# EAGLE schematic AddSub (EAGLE 8.5.1)
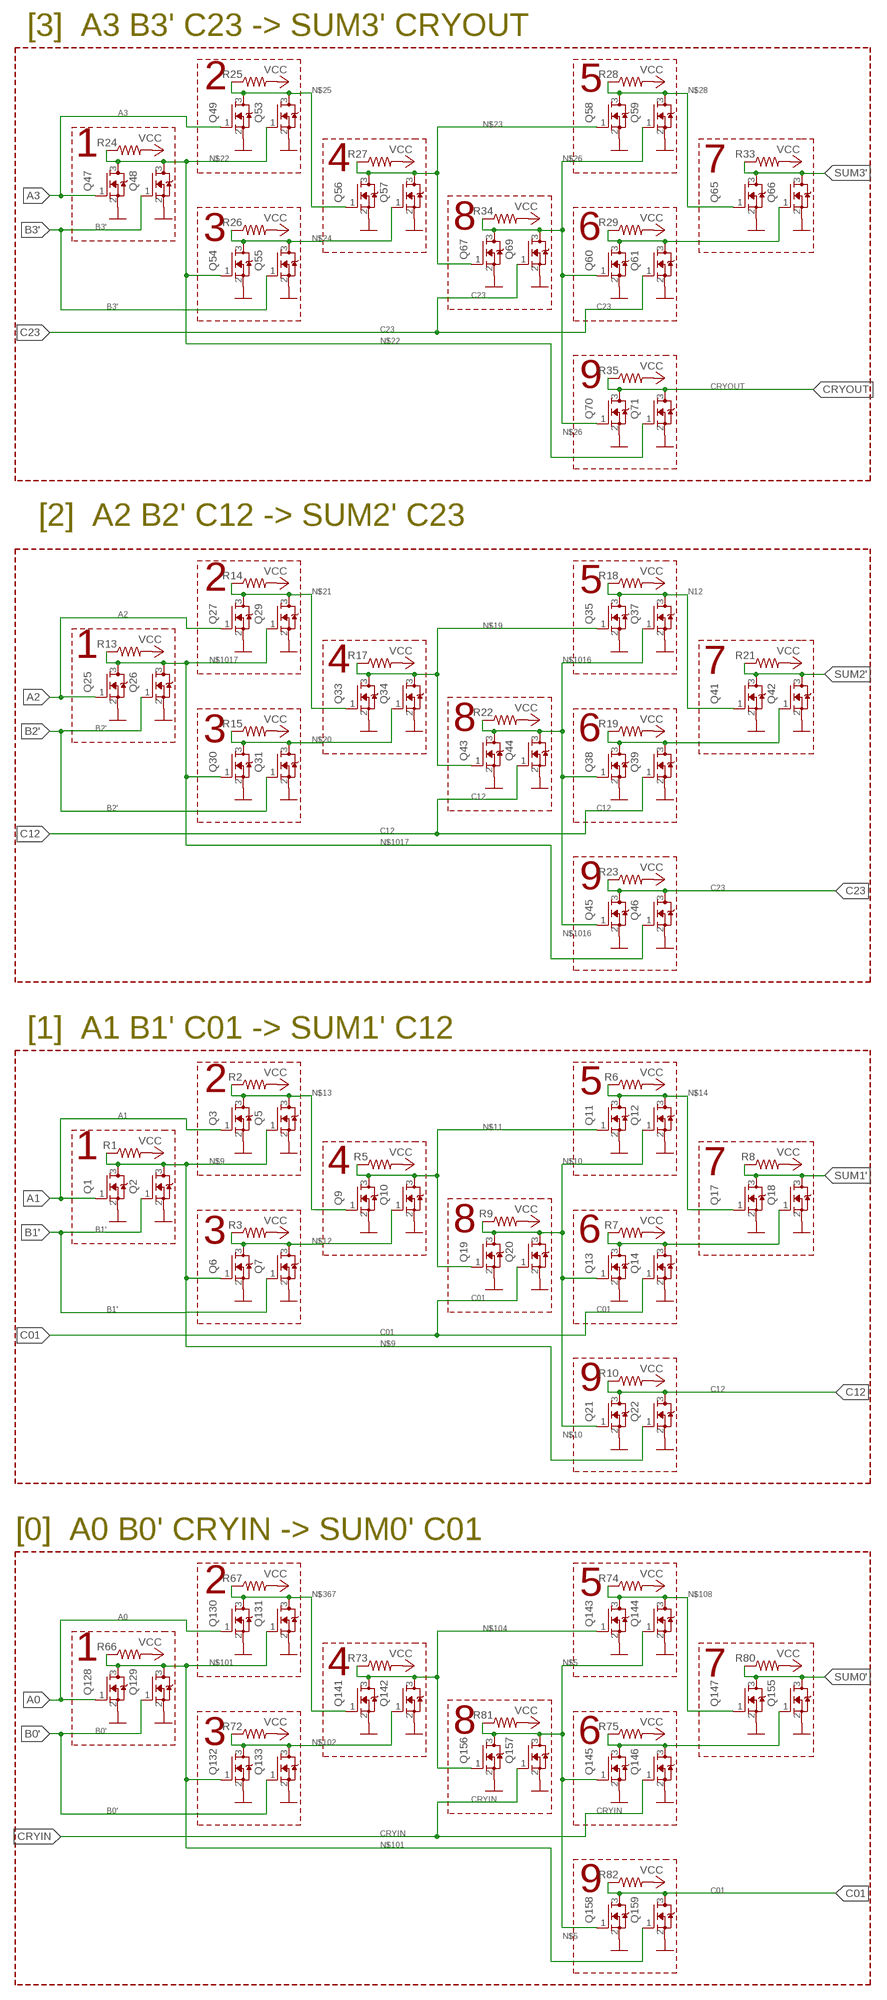
[diagram p0: schematic, sheet 1, part 1 of 2]
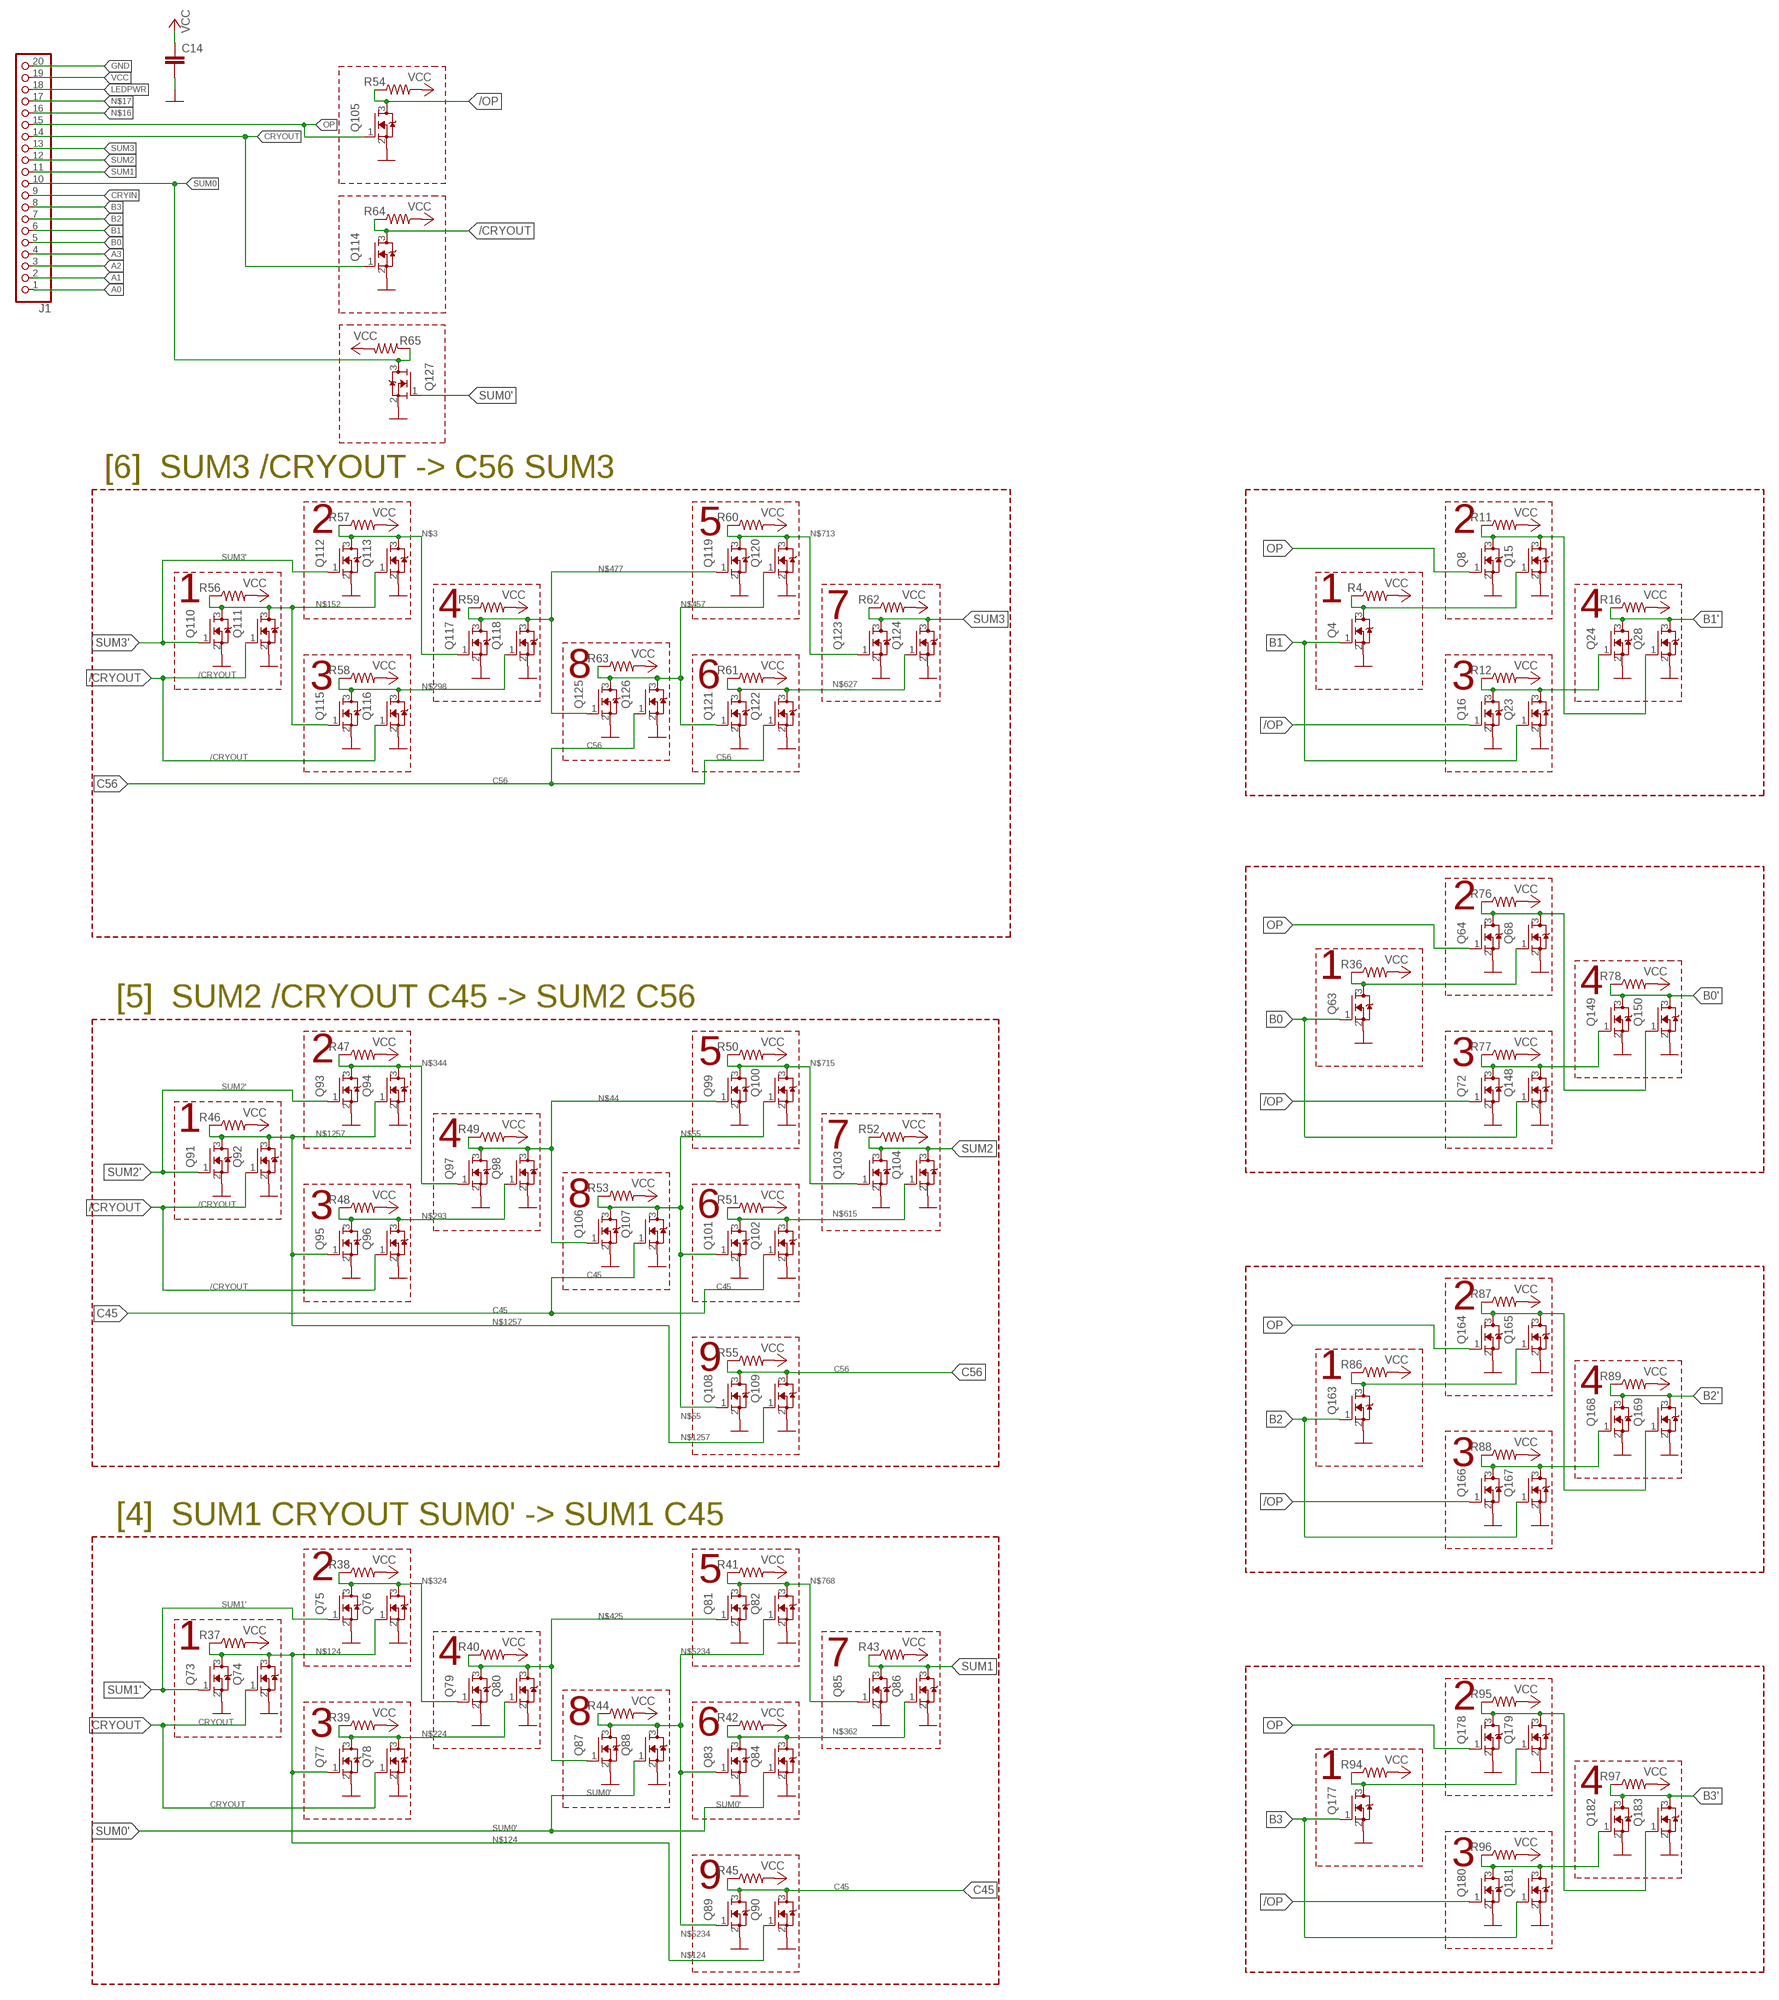
[diagram p1: schematic, sheet 1, part 2 of 2]

## Parts
C14  C-EUC0805  [C0805]
J1  PINHD-1X20/90  [1X20/90]
Q1  310mA/60V/1.6Ω  NMOSREFLOW  [SOT23]
Q2  310mA/60V/1.6Ω  NMOSREFLOW  [SOT23]
Q3  310mA/60V/1.6Ω  NMOSREFLOW  [SOT23]
Q4  310mA/60V/1.6Ω  NMOSREFLOW  [SOT23]
Q5  310mA/60V/1.6Ω  NMOSREFLOW  [SOT23]
Q6  310mA/60V/1.6Ω  NMOSREFLOW  [SOT23]
Q7  310mA/60V/1.6Ω  NMOSREFLOW  [SOT23]
Q8  310mA/60V/1.6Ω  NMOSREFLOW  [SOT23]
Q9  310mA/60V/1.6Ω  NMOSREFLOW  [SOT23]
Q10  310mA/60V/1.6Ω  NMOSREFLOW  [SOT23]
Q11  310mA/60V/1.6Ω  NMOSREFLOW  [SOT23]
Q12  310mA/60V/1.6Ω  NMOSREFLOW  [SOT23]
Q13  310mA/60V/1.6Ω  NMOSREFLOW  [SOT23]
Q14  310mA/60V/1.6Ω  NMOSREFLOW  [SOT23]
Q15  310mA/60V/1.6Ω  NMOSREFLOW  [SOT23]
Q16  310mA/60V/1.6Ω  NMOSREFLOW  [SOT23]
Q17  310mA/60V/1.6Ω  NMOSREFLOW  [SOT23]
Q18  310mA/60V/1.6Ω  NMOSREFLOW  [SOT23]
Q19  310mA/60V/1.6Ω  NMOSREFLOW  [SOT23]
Q20  310mA/60V/1.6Ω  NMOSREFLOW  [SOT23]
Q21  310mA/60V/1.6Ω  NMOSREFLOW  [SOT23]
Q22  310mA/60V/1.6Ω  NMOSREFLOW  [SOT23]
Q23  310mA/60V/1.6Ω  NMOSREFLOW  [SOT23]
Q24  310mA/60V/1.6Ω  NMOSREFLOW  [SOT23]
Q25  310mA/60V/1.6Ω  NMOSREFLOW  [SOT23]
Q26  310mA/60V/1.6Ω  NMOSREFLOW  [SOT23]
Q27  310mA/60V/1.6Ω  NMOSREFLOW  [SOT23]
Q28  310mA/60V/1.6Ω  NMOSREFLOW  [SOT23]
Q29  310mA/60V/1.6Ω  NMOSREFLOW  [SOT23]
Q30  310mA/60V/1.6Ω  NMOSREFLOW  [SOT23]
Q31  310mA/60V/1.6Ω  NMOSREFLOW  [SOT23]
Q33  310mA/60V/1.6Ω  NMOSREFLOW  [SOT23]
Q34  310mA/60V/1.6Ω  NMOSREFLOW  [SOT23]
Q35  310mA/60V/1.6Ω  NMOSREFLOW  [SOT23]
Q37  310mA/60V/1.6Ω  NMOSREFLOW  [SOT23]
Q38  310mA/60V/1.6Ω  NMOSREFLOW  [SOT23]
Q39  310mA/60V/1.6Ω  NMOSREFLOW  [SOT23]
Q41  310mA/60V/1.6Ω  NMOSREFLOW  [SOT23]
Q42  310mA/60V/1.6Ω  NMOSREFLOW  [SOT23]
Q43  310mA/60V/1.6Ω  NMOSREFLOW  [SOT23]
Q44  310mA/60V/1.6Ω  NMOSREFLOW  [SOT23]
Q45  310mA/60V/1.6Ω  NMOSREFLOW  [SOT23]
Q46  310mA/60V/1.6Ω  NMOSREFLOW  [SOT23]
Q47  310mA/60V/1.6Ω  NMOSREFLOW  [SOT23]
Q48  310mA/60V/1.6Ω  NMOSREFLOW  [SOT23]
Q49  310mA/60V/1.6Ω  NMOSREFLOW  [SOT23]
Q53  310mA/60V/1.6Ω  NMOSREFLOW  [SOT23]
Q54  310mA/60V/1.6Ω  NMOSREFLOW  [SOT23]
Q55  310mA/60V/1.6Ω  NMOSREFLOW  [SOT23]
Q56  310mA/60V/1.6Ω  NMOSREFLOW  [SOT23]
Q57  310mA/60V/1.6Ω  NMOSREFLOW  [SOT23]
Q58  310mA/60V/1.6Ω  NMOSREFLOW  [SOT23]
Q59  310mA/60V/1.6Ω  NMOSREFLOW  [SOT23]
Q60  310mA/60V/1.6Ω  NMOSREFLOW  [SOT23]
Q61  310mA/60V/1.6Ω  NMOSREFLOW  [SOT23]
Q63  310mA/60V/1.6Ω  NMOSREFLOW  [SOT23]
Q64  310mA/60V/1.6Ω  NMOSREFLOW  [SOT23]
Q65  310mA/60V/1.6Ω  NMOSREFLOW  [SOT23]
Q66  310mA/60V/1.6Ω  NMOSREFLOW  [SOT23]
Q67  310mA/60V/1.6Ω  NMOSREFLOW  [SOT23]
Q68  310mA/60V/1.6Ω  NMOSREFLOW  [SOT23]
Q69  310mA/60V/1.6Ω  NMOSREFLOW  [SOT23]
Q70  310mA/60V/1.6Ω  NMOSREFLOW  [SOT23]
Q71  310mA/60V/1.6Ω  NMOSREFLOW  [SOT23]
Q72  310mA/60V/1.6Ω  NMOSREFLOW  [SOT23]
Q73  310mA/60V/1.6Ω  NMOSREFLOW  [SOT23]
Q74  310mA/60V/1.6Ω  NMOSREFLOW  [SOT23]
Q75  310mA/60V/1.6Ω  NMOSREFLOW  [SOT23]
Q76  310mA/60V/1.6Ω  NMOSREFLOW  [SOT23]
Q77  310mA/60V/1.6Ω  NMOSREFLOW  [SOT23]
Q78  310mA/60V/1.6Ω  NMOSREFLOW  [SOT23]
Q79  310mA/60V/1.6Ω  NMOSREFLOW  [SOT23]
Q80  310mA/60V/1.6Ω  NMOSREFLOW  [SOT23]
Q81  310mA/60V/1.6Ω  NMOSREFLOW  [SOT23]
Q82  310mA/60V/1.6Ω  NMOSREFLOW  [SOT23]
Q83  310mA/60V/1.6Ω  NMOSREFLOW  [SOT23]
Q84  310mA/60V/1.6Ω  NMOSREFLOW  [SOT23]
Q85  310mA/60V/1.6Ω  NMOSREFLOW  [SOT23]
Q86  310mA/60V/1.6Ω  NMOSREFLOW  [SOT23]
Q87  310mA/60V/1.6Ω  NMOSREFLOW  [SOT23]
Q88  310mA/60V/1.6Ω  NMOSREFLOW  [SOT23]
Q89  310mA/60V/1.6Ω  NMOSREFLOW  [SOT23]
Q90  310mA/60V/1.6Ω  NMOSREFLOW  [SOT23]
Q91  310mA/60V/1.6Ω  NMOSREFLOW  [SOT23]
Q92  310mA/60V/1.6Ω  NMOSREFLOW  [SOT23]
Q93  310mA/60V/1.6Ω  NMOSREFLOW  [SOT23]
Q94  310mA/60V/1.6Ω  NMOSREFLOW  [SOT23]
Q95  310mA/60V/1.6Ω  NMOSREFLOW  [SOT23]
Q96  310mA/60V/1.6Ω  NMOSREFLOW  [SOT23]
Q97  310mA/60V/1.6Ω  NMOSREFLOW  [SOT23]
Q98  310mA/60V/1.6Ω  NMOSREFLOW  [SOT23]
Q99  310mA/60V/1.6Ω  NMOSREFLOW  [SOT23]
Q100  310mA/60V/1.6Ω  NMOSREFLOW  [SOT23]
Q101  310mA/60V/1.6Ω  NMOSREFLOW  [SOT23]
Q102  310mA/60V/1.6Ω  NMOSREFLOW  [SOT23]
Q103  310mA/60V/1.6Ω  NMOSREFLOW  [SOT23]
Q104  310mA/60V/1.6Ω  NMOSREFLOW  [SOT23]
Q105  310mA/60V/1.6Ω  NMOSREFLOW  [SOT23]
Q106  310mA/60V/1.6Ω  NMOSREFLOW  [SOT23]
Q107  310mA/60V/1.6Ω  NMOSREFLOW  [SOT23]
Q108  310mA/60V/1.6Ω  NMOSREFLOW  [SOT23]
Q109  310mA/60V/1.6Ω  NMOSREFLOW  [SOT23]
Q110  310mA/60V/1.6Ω  NMOSREFLOW  [SOT23]
Q111  310mA/60V/1.6Ω  NMOSREFLOW  [SOT23]
Q112  310mA/60V/1.6Ω  NMOSREFLOW  [SOT23]
Q113  310mA/60V/1.6Ω  NMOSREFLOW  [SOT23]
Q114  310mA/60V/1.6Ω  NMOSREFLOW  [SOT23]
Q115  310mA/60V/1.6Ω  NMOSREFLOW  [SOT23]
Q116  310mA/60V/1.6Ω  NMOSREFLOW  [SOT23]
Q117  310mA/60V/1.6Ω  NMOSREFLOW  [SOT23]
Q118  310mA/60V/1.6Ω  NMOSREFLOW  [SOT23]
Q119  310mA/60V/1.6Ω  NMOSREFLOW  [SOT23]
Q120  310mA/60V/1.6Ω  NMOSREFLOW  [SOT23]
Q121  310mA/60V/1.6Ω  NMOSREFLOW  [SOT23]
Q122  310mA/60V/1.6Ω  NMOSREFLOW  [SOT23]
Q123  310mA/60V/1.6Ω  NMOSREFLOW  [SOT23]
Q124  310mA/60V/1.6Ω  NMOSREFLOW  [SOT23]
Q125  310mA/60V/1.6Ω  NMOSREFLOW  [SOT23]
Q126  310mA/60V/1.6Ω  NMOSREFLOW  [SOT23]
Q127  310mA/60V/1.6Ω  NMOSREFLOW  [SOT23]
Q128  310mA/60V/1.6Ω  NMOSREFLOW  [SOT23]
Q129  310mA/60V/1.6Ω  NMOSREFLOW  [SOT23]
Q130  310mA/60V/1.6Ω  NMOSREFLOW  [SOT23]
Q131  310mA/60V/1.6Ω  NMOSREFLOW  [SOT23]
Q132  310mA/60V/1.6Ω  NMOSREFLOW  [SOT23]
Q133  310mA/60V/1.6Ω  NMOSREFLOW  [SOT23]
Q141  310mA/60V/1.6Ω  NMOSREFLOW  [SOT23]
Q142  310mA/60V/1.6Ω  NMOSREFLOW  [SOT23]
Q143  310mA/60V/1.6Ω  NMOSREFLOW  [SOT23]
Q144  310mA/60V/1.6Ω  NMOSREFLOW  [SOT23]
Q145  310mA/60V/1.6Ω  NMOSREFLOW  [SOT23]
Q146  310mA/60V/1.6Ω  NMOSREFLOW  [SOT23]
Q147  310mA/60V/1.6Ω  NMOSREFLOW  [SOT23]
Q148  310mA/60V/1.6Ω  NMOSREFLOW  [SOT23]
Q149  310mA/60V/1.6Ω  NMOSREFLOW  [SOT23]
Q150  310mA/60V/1.6Ω  NMOSREFLOW  [SOT23]
Q155  310mA/60V/1.6Ω  NMOSREFLOW  [SOT23]
Q156  310mA/60V/1.6Ω  NMOSREFLOW  [SOT23]
Q157  310mA/60V/1.6Ω  NMOSREFLOW  [SOT23]
Q158  310mA/60V/1.6Ω  NMOSREFLOW  [SOT23]
Q159  310mA/60V/1.6Ω  NMOSREFLOW  [SOT23]
Q163  310mA/60V/1.6Ω  NMOSREFLOW  [SOT23]
Q164  310mA/60V/1.6Ω  NMOSREFLOW  [SOT23]
Q165  310mA/60V/1.6Ω  NMOSREFLOW  [SOT23]
Q166  310mA/60V/1.6Ω  NMOSREFLOW  [SOT23]
Q167  310mA/60V/1.6Ω  NMOSREFLOW  [SOT23]
Q168  310mA/60V/1.6Ω  NMOSREFLOW  [SOT23]
Q169  310mA/60V/1.6Ω  NMOSREFLOW  [SOT23]
Q177  310mA/60V/1.6Ω  NMOSREFLOW  [SOT23]
Q178  310mA/60V/1.6Ω  NMOSREFLOW  [SOT23]
Q179  310mA/60V/1.6Ω  NMOSREFLOW  [SOT23]
Q180  310mA/60V/1.6Ω  NMOSREFLOW  [SOT23]
Q181  310mA/60V/1.6Ω  NMOSREFLOW  [SOT23]
Q182  310mA/60V/1.6Ω  NMOSREFLOW  [SOT23]
Q183  310mA/60V/1.6Ω  NMOSREFLOW  [SOT23]
R1  RESISTOR0805  [0805]
R2  RESISTOR0805  [0805]
R3  RESISTOR0805  [0805]
R4  RESISTOR0805  [0805]
R5  RESISTOR0805  [0805]
R6  RESISTOR0805  [0805]
R7  RESISTOR0805  [0805]
R8  RESISTOR0805  [0805]
R9  RESISTOR0805  [0805]
R10  RESISTOR0805  [0805]
R11  RESISTOR0805  [0805]
R12  RESISTOR0805  [0805]
R13  RESISTOR0805  [0805]
R14  RESISTOR0805  [0805]
R15  RESISTOR0805  [0805]
R16  RESISTOR0805  [0805]
R17  RESISTOR0805  [0805]
R18  RESISTOR0805  [0805]
R19  RESISTOR0805  [0805]
R21  RESISTOR0805  [0805]
R22  RESISTOR0805  [0805]
R23  RESISTOR0805  [0805]
R24  RESISTOR0805  [0805]
R25  RESISTOR0805  [0805]
R26  RESISTOR0805  [0805]
R27  RESISTOR0805  [0805]
R28  RESISTOR0805  [0805]
R29  RESISTOR0805  [0805]
R33  RESISTOR0805  [0805]
R34  RESISTOR0805  [0805]
R35  RESISTOR0805  [0805]
R36  RESISTOR0805  [0805]
R37  RESISTOR0805  [0805]
R38  RESISTOR0805  [0805]
R39  RESISTOR0805  [0805]
R40  RESISTOR0805  [0805]
R41  RESISTOR0805  [0805]
R42  RESISTOR0805  [0805]
R43  RESISTOR0805  [0805]
R44  RESISTOR0805  [0805]
R45  RESISTOR0805  [0805]
R46  RESISTOR0805  [0805]
R47  RESISTOR0805  [0805]
R48  RESISTOR0805  [0805]
R49  RESISTOR0805  [0805]
R50  RESISTOR0805  [0805]
R51  RESISTOR0805  [0805]
R52  RESISTOR0805  [0805]
R53  RESISTOR0805  [0805]
R54  RESISTOR0805  [0805]
R55  RESISTOR0805  [0805]
R56  RESISTOR0805  [0805]
R57  RESISTOR0805  [0805]
R58  RESISTOR0805  [0805]
R59  RESISTOR0805  [0805]
R60  RESISTOR0805  [0805]
R61  RESISTOR0805  [0805]
R62  RESISTOR0805  [0805]
R63  RESISTOR0805  [0805]
R64  RESISTOR0805  [0805]
R65  RESISTOR0805  [0805]
R66  RESISTOR0805  [0805]
R67  RESISTOR0805  [0805]
R72  RESISTOR0805  [0805]
R73  RESISTOR0805  [0805]
R74  RESISTOR0805  [0805]
R75  RESISTOR0805  [0805]
R76  RESISTOR0805  [0805]
R77  RESISTOR0805  [0805]
R78  RESISTOR0805  [0805]
R80  RESISTOR0805  [0805]
R81  RESISTOR0805  [0805]
R82  RESISTOR0805  [0805]
R86  RESISTOR0805  [0805]
R87  RESISTOR0805  [0805]
R88  RESISTOR0805  [0805]
R89  RESISTOR0805  [0805]
R94  RESISTOR0805  [0805]
R95  RESISTOR0805  [0805]
R96  RESISTOR0805  [0805]
R97  RESISTOR0805  [0805]

## Nets
/CRYOUT [narrow]: Q92.1(G) Q96.1(G) Q111.1(G) Q114.3(D) Q116.1(G) R64.1
/OP [narrow]: Q16.1(G) Q72.1(G) Q105.3(D) Q166.1(G) Q180.1(G) R54.1
A0: J1.1 Q128.1(G) Q130.1(G)
A1: J1.2 Q1.1(G) Q3.1(G)
A2: J1.3 Q25.1(G) Q27.1(G)
A3: J1.4 Q47.1(G) Q49.1(G)
B0: J1.5 Q63.1(G) Q148.1(G)
B0': Q129.1(G) Q133.1(G) Q149.3(D) Q150.3(D) R78.1
B1: J1.6 Q4.1(G) Q23.1(G)
B1': Q2.1(G) Q7.1(G) Q24.3(D) Q28.3(D) R16.1
B2: J1.7 Q163.1(G) Q167.1(G)
B2': Q26.1(G) Q31.1(G) Q168.3(D) Q169.3(D) R89.1
B3: J1.8 Q177.1(G) Q181.1(G)
B3': Q48.1(G) Q55.1(G) Q182.3(D) Q183.3(D) R97.1
C01: Q14.1(G) Q20.1(G) Q158.3(D) Q159.3(D) R82.1
C12: Q21.3(D) Q22.3(D) Q39.1(G) Q44.1(G) R10.1
C23: Q45.3(D) Q46.3(D) Q61.1(G) Q69.1(G) R23.1
C45: Q89.3(D) Q90.3(D) Q102.1(G) Q107.1(G) R45.1
C56: Q108.3(D) Q109.3(D) Q122.1(G) Q126.1(G) R55.1
CRYIN: J1.9 Q146.1(G) Q157.1(G)
CRYOUT: J1.14 Q70.3(D) Q71.3(D) Q74.1(G) Q78.1(G) Q114.1(G) R35.1
GND: C14.2 J1.20 Q1.2(S) Q2.2(S) Q3.2(S) Q4.2(S) Q5.2(S) Q6.2(S) Q7.2(S) Q8.2(S) Q9.2(S) Q10.2(S) Q11.2(S) Q12.2(S) Q13.2(S) Q14.2(S) Q15.2(S) Q16.2(S) Q17.2(S) Q18.2(S) Q19.2(S) Q20.2(S) Q21.2(S) Q22.2(S) Q23.2(S) Q24.2(S) Q25.2(S) Q26.2(S) Q27.2(S) Q28.2(S) Q29.2(S) Q30.2(S) Q31.2(S) Q33.2(S) Q34.2(S) Q35.2(S) Q37.2(S) Q38.2(S) Q39.2(S) Q41.2(S) Q42.2(S) Q43.2(S) Q44.2(S) Q45.2(S) Q46.2(S) Q47.2(S) Q48.2(S) Q49.2(S) Q53.2(S) Q54.2(S) Q55.2(S) Q56.2(S) Q57.2(S) Q58.2(S) Q59.2(S) Q60.2(S) Q61.2(S) Q63.2(S) Q64.2(S) Q65.2(S) Q66.2(S) Q67.2(S) Q68.2(S) Q69.2(S) Q70.2(S) Q71.2(S) Q72.2(S) Q73.2(S) Q74.2(S) Q75.2(S) Q76.2(S) Q77.2(S) Q78.2(S) Q79.2(S) Q80.2(S) Q81.2(S) Q82.2(S) Q83.2(S) Q84.2(S) Q85.2(S) Q86.2(S) Q87.2(S) Q88.2(S) Q89.2(S) Q90.2(S) Q91.2(S) Q92.2(S) Q93.2(S) Q94.2(S) Q95.2(S) Q96.2(S) Q97.2(S) Q98.2(S) Q99.2(S) Q100.2(S) Q101.2(S) Q102.2(S) Q103.2(S) Q104.2(S) Q105.2(S) Q106.2(S) Q107.2(S) Q108.2(S) Q109.2(S) Q110.2(S) Q111.2(S) Q112.2(S) Q113.2(S) Q114.2(S) Q115.2(S) Q116.2(S) Q117.2(S) Q118.2(S) Q119.2(S) Q120.2(S) Q121.2(S) Q122.2(S) Q123.2(S) Q124.2(S) Q125.2(S) Q126.2(S) Q127.2(S) Q128.2(S) Q129.2(S) Q130.2(S) Q131.2(S) Q132.2(S) Q133.2(S) Q141.2(S) Q142.2(S) Q143.2(S) Q144.2(S) Q145.2(S) Q146.2(S) Q147.2(S) Q148.2(S) Q149.2(S) Q150.2(S) Q155.2(S) Q156.2(S) Q157.2(S) Q158.2(S) Q159.2(S) Q163.2(S) Q164.2(S) Q165.2(S) Q166.2(S) Q167.2(S) Q168.2(S) Q169.2(S) Q177.2(S) Q178.2(S) Q179.2(S) Q180.2(S) Q181.2(S) Q182.2(S) Q183.2(S)
LEDPWR: J1.18
N12: Q35.3(D) Q37.3(D) Q41.1(G) R18.1
N$3: Q112.3(D) Q113.3(D) Q117.1(G) R57.1
N$5: Q144.1(G) Q145.1(G) Q156.3(D) Q157.3(D) Q158.1(G) R81.1
N$6 [narrow]: Q4.3(D) Q15.1(G) R4.1
N$7: Q8.3(D) Q15.3(D) Q28.1(G) R11.1
N$8: Q16.3(D) Q23.3(D) Q24.1(G) R12.1
N$9: Q1.3(D) Q2.3(D) Q5.1(G) Q6.1(G) Q22.1(G) R1.1
N$10: Q12.1(G) Q13.1(G) Q19.3(D) Q20.3(D) Q21.1(G) R9.1
N$11: Q9.3(D) Q10.3(D) Q11.1(G) Q19.1(G) R5.1
N$12: Q6.3(D) Q7.3(D) Q10.1(G) R3.1
N$13: Q3.3(D) Q5.3(D) Q9.1(G) R2.1
N$14: Q11.3(D) Q12.3(D) Q17.1(G) R6.1
N$15: Q13.3(D) Q14.3(D) Q18.1(G) R7.1
N$16: J1.16
N$17: J1.17
N$18: Q38.3(D) Q39.3(D) Q42.1(G) R19.1
N$19: Q33.3(D) Q34.3(D) Q35.1(G) Q43.1(G) R17.1
N$20: Q30.3(D) Q31.3(D) Q34.1(G) R15.1
N$21: Q27.3(D) Q29.3(D) Q33.1(G) R14.1
N$22: Q47.3(D) Q48.3(D) Q53.1(G) Q54.1(G) Q71.1(G) R24.1
N$23: Q56.3(D) Q57.3(D) Q58.1(G) Q67.1(G) R27.1
N$24: Q54.3(D) Q55.3(D) Q57.1(G) R26.1
N$25: Q49.3(D) Q53.3(D) Q56.1(G) R25.1
N$26: Q59.1(G) Q60.1(G) Q67.3(D) Q69.3(D) Q70.1(G) R34.1
N$27: Q60.3(D) Q61.3(D) Q66.1(G) R29.1
N$28: Q58.3(D) Q59.3(D) Q65.1(G) R28.1
N$32 [narrow]: Q63.3(D) Q68.1(G) R36.1
N$33: Q64.3(D) Q68.3(D) Q150.1(G) R76.1
N$34: Q72.3(D) Q148.3(D) Q149.1(G) R77.1
N$38 [narrow]: Q163.3(D) Q165.1(G) R86.1
N$39: Q164.3(D) Q165.3(D) Q169.1(G) R87.1
N$40: Q166.3(D) Q167.3(D) Q168.1(G) R88.1
N$44 [narrow]: Q97.3(D) Q98.3(D) Q99.1(G) Q106.1(G) R49.1
N$45 [narrow]: Q177.3(D) Q179.1(G) R94.1
N$46: Q178.3(D) Q179.3(D) Q183.1(G) R95.1
N$47: Q180.3(D) Q181.3(D) Q182.1(G) R96.1
N$55: Q100.1(G) Q101.1(G) Q106.3(D) Q107.3(D) Q108.1(G) R53.1
N$101 [narrow]: Q128.3(D) Q129.3(D) Q131.1(G) Q132.1(G) Q159.1(G) R66.1
N$102: Q132.3(D) Q133.3(D) Q142.1(G) R72.1
N$104 [narrow]: Q141.3(D) Q142.3(D) Q143.1(G) Q156.1(G) R73.1
N$106 [narrow]: Q145.3(D) Q146.3(D) Q155.1(G) R75.1
N$108 [narrow]: Q143.3(D) Q144.3(D) Q147.1(G) R74.1
N$124 [narrow]: Q73.3(D) Q74.3(D) Q76.1(G) Q77.1(G) Q90.1(G) R37.1
N$152 [narrow]: Q110.3(D) Q111.3(D) Q113.1(G) Q115.1(G) R56.1
N$224: Q77.3(D) Q78.3(D) Q80.1(G) R39.1
N$293: Q95.3(D) Q96.3(D) Q98.1(G) R48.1
N$298: Q115.3(D) Q116.3(D) Q118.1(G) R58.1
N$324: Q75.3(D) Q76.3(D) Q79.1(G) R38.1
N$344: Q93.3(D) Q94.3(D) Q97.1(G) R47.1
N$362 [narrow]: Q83.3(D) Q84.3(D) Q86.1(G) R42.1
N$367: Q130.3(D) Q131.3(D) Q141.1(G) R67.1
N$425 [narrow]: Q79.3(D) Q80.3(D) Q81.1(G) Q87.1(G) R40.1
N$457: Q120.1(G) Q121.1(G) Q125.3(D) Q126.3(D) R63.1
N$477 [narrow]: Q117.3(D) Q118.3(D) Q119.1(G) Q125.1(G) R59.1
N$615 [narrow]: Q101.3(D) Q102.3(D) Q104.1(G) R51.1
N$627 [narrow]: Q121.3(D) Q122.3(D) Q124.1(G) R61.1
N$713: Q119.3(D) Q120.3(D) Q123.1(G) R60.1
N$715: Q99.3(D) Q100.3(D) Q103.1(G) R50.1
N$768: Q81.3(D) Q82.3(D) Q85.1(G) R41.1
N$1016: Q37.1(G) Q38.1(G) Q43.3(D) Q44.3(D) Q45.1(G) R22.1
N$1017: Q25.3(D) Q26.3(D) Q29.1(G) Q30.1(G) Q46.1(G) R13.1
N$1257 [narrow]: Q91.3(D) Q92.3(D) Q94.1(G) Q95.1(G) Q109.1(G) R46.1
N$5234: Q82.1(G) Q83.1(G) Q87.3(D) Q88.3(D) Q89.1(G) R44.1
OP: J1.15 Q8.1(G) Q64.1(G) Q105.1(G) Q164.1(G) Q178.1(G)
SUM0: J1.10 Q127.3(D) R65.1
SUM0': Q84.1(G) Q88.1(G) Q127.1(G) Q147.3(D) Q155.3(D) R80.1
SUM1: J1.11 Q85.3(D) Q86.3(D) R43.1
SUM1': Q17.3(D) Q18.3(D) Q73.1(G) Q75.1(G) R8.1
SUM2: J1.12 Q103.3(D) Q104.3(D) R52.1
SUM2': Q41.3(D) Q42.3(D) Q91.1(G) Q93.1(G) R21.1
SUM3: J1.13 Q123.3(D) Q124.3(D) R62.1
SUM3': Q65.3(D) Q66.3(D) Q110.1(G) Q112.1(G) R33.1
VCC: C14.1 J1.19 R1.2 R2.2 R3.2 R4.2 R5.2 R6.2 R7.2 R8.2 R9.2 R10.2 R11.2 R12.2 R13.2 R14.2 R15.2 R16.2 R17.2 R18.2 R19.2 R21.2 R22.2 R23.2 R24.2 R25.2 R26.2 R27.2 R28.2 R29.2 R33.2 R34.2 R35.2 R36.2 R37.2 R38.2 R39.2 R40.2 R41.2 R42.2 R43.2 R44.2 R45.2 R46.2 R47.2 R48.2 R49.2 R50.2 R51.2 R52.2 R53.2 R54.2 R55.2 R56.2 R57.2 R58.2 R59.2 R60.2 R61.2 R62.2 R63.2 R64.2 R65.2 R66.2 R67.2 R72.2 R73.2 R74.2 R75.2 R76.2 R77.2 R78.2 R80.2 R81.2 R82.2 R86.2 R87.2 R88.2 R89.2 R94.2 R95.2 R96.2 R97.2

## Notes on the sheet
- [3]  A3 B3' C23 -> SUM3' CRYOUT
- 2 | 5
- 1
- 4 | 7
- 3 | 8 | 6
- 9
- [2]  A2 B2' C12 -> SUM2' C23 | [6]  SUM3 /CRYOUT -> C56 SUM3
- 2 | 2 | 5 | 2
- 5
- 1 | 1 | 1
- 4 | 4 | 7 | 4
- 7
- 8 | 3 | 8 | 6 | 3
- 3 | 6
- 9
- 2
- 1
- 4
- [1]  A1 B1' C01 -> SUM1' C12 | [5]  SUM2 /CRYOUT C45 -> SUM2 C56
- 2 | 5 | 2 | 5 | 3
- 1 | 1
- 4 | 7 | 4 | 7
- 3 | 8 | 6 | 3 | 8 | 6
- 2
- 9 | 9 | 1
- 4
- 3
- [0]  A0 B0' CRYIN -> SUM0' C01 | [4]  SUM1 CRYOUT SUM0' -> SUM1 C45
- 2 | 5 | 2 | 5
- 1 | 1
- 4 | 7 | 4 | 7
- 2
- 3 | 8 | 6 | 3 | 8 | 6
- 1
- 4
- 3
- 9 | 9

## Library data of the parts
C14 = rcl:C-EU: CAPACITOR, European symbol; SPICEPREFIX: C
J1 = XSNOR:PINHD-1X20: PIN HEADER
Q1-Q31 Q33-Q35 Q37-Q39 Q41-Q49 Q53-Q61 Q63-Q133 Q141-Q150 Q155-Q159 Q163-Q169 Q177-Q183 = XSNOR:NMOS: N-Channel Mosfet 2N7002E - 60V 260mA SOT23 [Digikey: 2N7002ET1GOSTR-ND] - REEL BSH103 - 30V 850mA SOT23 [Digikey: 568-5013-1-ND]
R1-R19 R21-R29 R33-R67 R72-R78 R80-R82 R86-R89 R94-R97 = XSNOR:RESISTOR: Generic Resistor Package

## Net classes
0 default: width 0.2 mm, drill 0.305 mm, clearance 0.2 mm
1 narrow: width 0.2 mm, drill 0.305 mm, clearance 0.2 mm